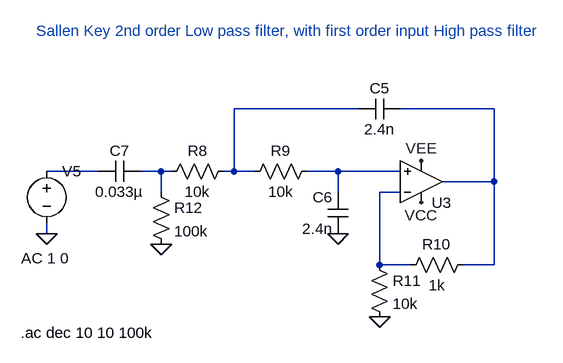
[diagram p0: schematic Anti-Aliasing Filter.asc]
Anti-Aliasing Filter.asc, the LTspice schematic file:
Version 4
SHEET 1 900 1400
WIRE 240 1040 48 1040
WIRE 448 1040 304 1040
WIRE -160 1136 -240 1136
WIRE -64 1136 -96 1136
WIRE -48 1136 -64 1136
WIRE 48 1136 48 1040
WIRE 48 1136 32 1136
WIRE 80 1136 48 1136
WIRE 208 1136 160 1136
WIRE 304 1136 208 1136
WIRE 448 1152 448 1040
WIRE 448 1152 368 1152
WIRE -64 1168 -64 1136
WIRE 208 1168 208 1136
WIRE 304 1168 272 1168
WIRE -240 1232 -240 1216
WIRE 272 1280 272 1168
WIRE 320 1280 272 1280
WIRE 448 1280 448 1152
WIRE 448 1280 400 1280
FLAG 208 1232 0
FLAG 336 1184 VCC
FLAG 336 1120 VEE
FLAG -240 1232 0
FLAG 272 1360 0
FLAG -64 1248 0
SYMBOL cap 304 1024 R90
WINDOW 0 0 32 VBottom 2
WINDOW 3 32 32 VTop 2
SYMATTR InstName C5
SYMATTR Value 2.4n
SYMBOL cap 224 1232 R180
WINDOW 0 24 56 Left 2
WINDOW 3 24 8 Left 2
SYMATTR InstName C6
SYMATTR Value 2.4n
SYMBOL res 48 1120 R90
WINDOW 0 0 56 VBottom 2
WINDOW 3 32 56 VTop 2
SYMATTR InstName R8
SYMATTR Value 10k
SYMBOL res 176 1120 R90
WINDOW 0 0 56 VBottom 2
WINDOW 3 32 56 VTop 2
SYMATTR InstName R9
SYMATTR Value 10k
SYMBOL Opamps\\UniversalOpAmp 336 1152 M180
SYMATTR InstName U3
SYMBOL voltage -240 1120 R0
WINDOW 123 -39 150 Left 2
WINDOW 39 0 0 Left 0
SYMATTR InstName V5
SYMATTR Value ""
SYMATTR Value2 AC 1 0
SYMBOL res 416 1264 R90
WINDOW 0 0 56 VBottom 2
WINDOW 3 32 56 VTop 2
SYMATTR InstName R10
SYMATTR Value 1k
SYMBOL res 256 1264 R0
SYMATTR InstName R11
SYMATTR Value 10k
SYMBOL res -80 1152 R0
SYMATTR InstName R12
SYMATTR Value 100k
SYMBOL cap -96 1120 R90
WINDOW 0 0 32 VBottom 2
WINDOW 3 32 32 VTop 2
SYMATTR InstName C7
SYMATTR Value 0.033µ
TEXT -280 1384 Left 2 !.ac dec 10 10 100k
TEXT -256 920 Left 2 ;Sallen Key 2nd order Low pass filter, with first order input High pass filter

The netlist it stands for:
* Anti-Aliasing Filter.asc
C5 N002 N001 2.4n
C6 0 N005 2.4n
R8 N001 N004 10k
R9 N005 N001 10k
XU3 N005 N006 VCC VEE N002 level1 Avol=1Meg GBW=10Meg Vos=0 En=0 Enk=0 In=0 Ink=0 Rin=500Meg  ; pins In+ In- V+ V- OUT
V5 N003 0 AC 1 0
R10 N002 N006 1k
R11 N006 0 10k
R12 N004 0 100k
C7 N004 N003 0.033µ
.ac dec 10 10 100k
* Sallen Key 2nd order Low pass filter, with first order input High pass filter
.lib UniversalOpAmp1.lib
.backanno
.end